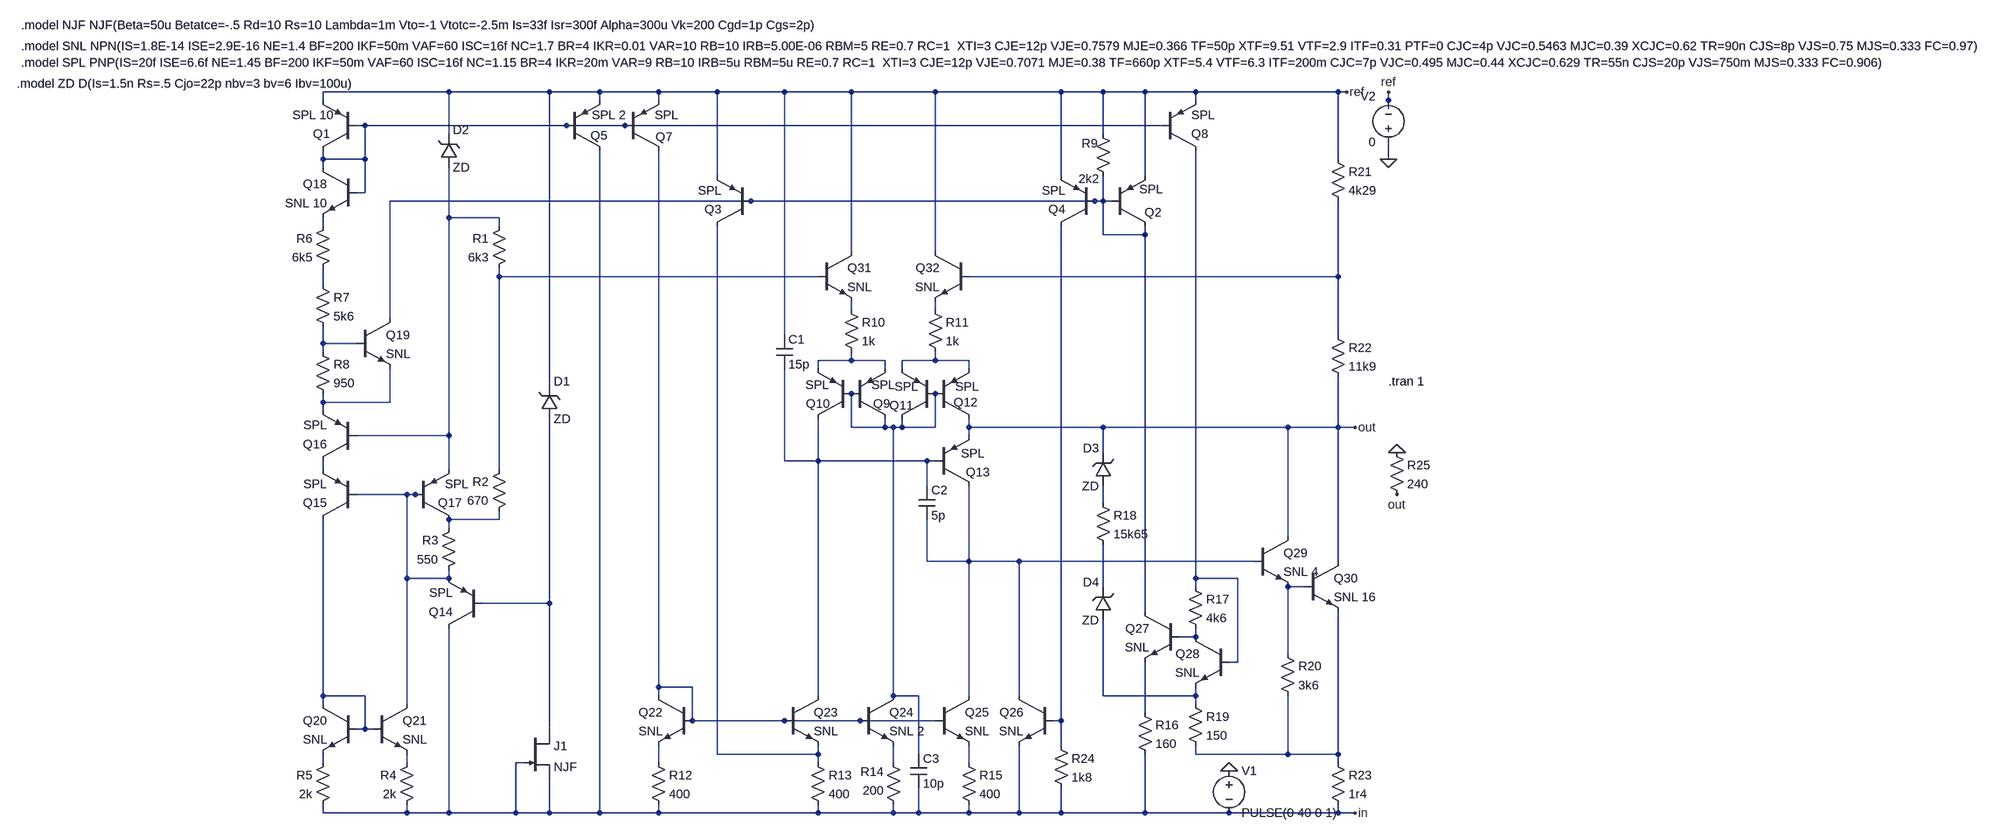
[diagram p0: schematic 79L24_test.asc]
79L24_test.asc, the LTspice schematic file:
Version 4
SHEET 1 5476 776
WIRE 2096 -736 1856 -736
WIRE 2288 -736 2096 -736
WIRE 2384 -736 2288 -736
WIRE 2496 -736 2384 -736
WIRE 2608 -736 2496 -736
WIRE 2736 -736 2608 -736
WIRE 2864 -736 2736 -736
WIRE 3024 -736 2864 -736
WIRE 3264 -736 3024 -736
WIRE 3344 -736 3264 -736
WIRE 3424 -736 3344 -736
WIRE 3520 -736 3424 -736
WIRE 3792 -736 3520 -736
WIRE 3808 -736 3792 -736
WIRE 1856 -720 1856 -736
WIRE 2384 -720 2384 -736
WIRE 2496 -720 2496 -736
WIRE 3520 -720 3520 -736
WIRE 3888 -720 3888 -736
WIRE 3888 -704 3888 -720
WIRE 1936 -672 1920 -672
WIRE 2320 -672 1936 -672
WIRE 2432 -672 2320 -672
WIRE 3456 -672 2432 -672
WIRE 2096 -656 2096 -736
WIRE 3344 -656 3344 -736
WIRE 1856 -608 1856 -624
WIRE 1936 -608 1936 -672
WIRE 1936 -608 1856 -608
WIRE 3792 -608 3792 -736
WIRE 3888 -608 3888 -640
WIRE 1856 -592 1856 -608
WIRE 2608 -576 2608 -736
WIRE 3264 -576 3264 -736
WIRE 3424 -576 3424 -736
WIRE 1936 -544 1936 -608
WIRE 1936 -544 1920 -544
WIRE 2672 -528 1984 -528
WIRE 3328 -528 2672 -528
WIRE 3344 -528 3344 -576
WIRE 3344 -528 3328 -528
WIRE 3360 -528 3344 -528
WIRE 2096 -496 2096 -592
WIRE 2192 -496 2096 -496
WIRE 1856 -480 1856 -496
WIRE 2192 -480 2192 -496
WIRE 3344 -464 3344 -528
WIRE 3424 -464 3424 -480
WIRE 3424 -464 3344 -464
WIRE 2864 -432 2864 -736
WIRE 3024 -432 3024 -736
WIRE 2192 -384 2192 -400
WIRE 2800 -384 2192 -384
WIRE 3792 -384 3792 -528
WIRE 3792 -384 3088 -384
WIRE 1856 -368 1856 -400
WIRE 2864 -320 2864 -336
WIRE 3024 -320 3024 -336
WIRE 1984 -304 1984 -528
WIRE 2736 -272 2736 -736
WIRE 3792 -272 3792 -384
WIRE 1856 -256 1856 -288
WIRE 1920 -256 1856 -256
WIRE 1856 -240 1856 -256
WIRE 2864 -224 2864 -240
WIRE 2864 -224 2800 -224
WIRE 2928 -224 2864 -224
WIRE 3024 -224 3024 -240
WIRE 3024 -224 2960 -224
WIRE 3088 -224 3024 -224
WIRE 2800 -208 2800 -224
WIRE 2928 -208 2928 -224
WIRE 2960 -208 2960 -224
WIRE 3088 -208 3088 -224
WIRE 2288 -176 2288 -736
WIRE 1856 -144 1856 -160
WIRE 1984 -144 1984 -208
WIRE 1984 -144 1856 -144
WIRE 1856 -128 1856 -144
WIRE 2864 -96 2864 -160
WIRE 2928 -96 2928 -112
WIRE 2928 -96 2864 -96
WIRE 2944 -96 2928 -96
WIRE 2960 -96 2960 -112
WIRE 2960 -96 2944 -96
WIRE 3024 -96 3024 -160
WIRE 3024 -96 2960 -96
WIRE 3088 -96 3088 -112
WIRE 3344 -96 3088 -96
WIRE 3696 -96 3344 -96
WIRE 3792 -96 3792 -192
WIRE 3792 -96 3696 -96
WIRE 3824 -96 3792 -96
WIRE 2096 -80 2096 -496
WIRE 2096 -80 1920 -80
WIRE 3088 -80 3088 -96
WIRE 3344 -48 3344 -96
WIRE 2736 -32 2736 -208
WIRE 2800 -32 2800 -112
WIRE 2800 -32 2736 -32
WIRE 3008 -32 2800 -32
WIRE 3024 -32 3008 -32
WIRE 1856 -16 1856 -32
WIRE 2096 -16 2096 -80
WIRE 2192 -16 2192 -384
WIRE 3008 16 3008 -32
WIRE 2016 32 1920 32
WIRE 2032 32 2016 32
WIRE 2048 32 2032 32
WIRE 3344 48 3344 16
WIRE 2192 80 2192 64
WIRE 2192 80 2096 80
WIRE 2096 96 2096 80
WIRE 3696 112 3696 -96
WIRE 3008 160 3008 80
WIRE 3088 160 3088 16
WIRE 3088 160 3008 160
WIRE 3184 160 3088 160
WIRE 3632 160 3184 160
WIRE 3792 160 3792 -96
WIRE 2016 192 2016 32
WIRE 2096 192 2096 176
WIRE 2096 192 2016 192
WIRE 3520 192 3520 -624
WIRE 3600 192 3520 192
WIRE 3344 208 3344 128
WIRE 3520 208 3520 192
WIRE 3728 208 3696 208
WIRE 2288 240 2288 -112
WIRE 2288 240 2160 240
WIRE 3424 256 3424 -464
WIRE 3520 304 3520 288
WIRE 3520 304 3488 304
WIRE 3696 336 3696 208
WIRE 3600 352 3600 192
WIRE 3600 352 3584 352
WIRE 2496 400 2496 -624
WIRE 2560 400 2496 400
WIRE 1856 416 1856 80
WIRE 1936 416 1856 416
WIRE 2496 416 2496 400
WIRE 2800 416 2800 -32
WIRE 2944 416 2944 -96
WIRE 2992 416 2944 416
WIRE 3088 416 3088 160
WIRE 3184 416 3184 160
WIRE 3344 416 3344 272
WIRE 3520 416 3520 400
WIRE 3520 416 3344 416
WIRE 1856 432 1856 416
WIRE 2016 432 2016 192
WIRE 3520 432 3520 416
WIRE 3424 448 3424 352
WIRE 2560 464 2560 400
WIRE 2736 464 2560 464
WIRE 2880 464 2736 464
WIRE 3024 464 2880 464
WIRE 3264 464 3264 -480
WIRE 3264 464 3248 464
WIRE 1936 480 1936 416
WIRE 1936 480 1920 480
WIRE 1952 480 1936 480
WIRE 2288 480 2288 240
WIRE 3264 512 3264 464
WIRE 2608 528 2608 -480
WIRE 2800 528 2800 512
WIRE 2800 528 2608 528
WIRE 2992 528 2992 416
WIRE 3520 528 3520 512
WIRE 3696 528 3696 416
WIRE 3696 528 3520 528
WIRE 3792 528 3792 256
WIRE 3792 528 3696 528
WIRE 1856 544 1856 528
WIRE 2016 544 2016 528
WIRE 2240 544 2224 544
WIRE 2496 544 2496 512
WIRE 2800 544 2800 528
WIRE 2944 544 2944 512
WIRE 3088 544 3088 512
WIRE 3792 544 3792 528
WIRE 1856 640 1856 624
WIRE 2016 640 2016 624
WIRE 2016 640 1856 640
WIRE 2096 640 2096 288
WIRE 2096 640 2016 640
WIRE 2224 640 2224 544
WIRE 2224 640 2096 640
WIRE 2288 640 2288 576
WIRE 2288 640 2224 640
WIRE 2384 640 2384 -624
WIRE 2384 640 2288 640
WIRE 2496 640 2496 624
WIRE 2496 640 2384 640
WIRE 2800 640 2800 624
WIRE 2800 640 2496 640
WIRE 2944 640 2944 624
WIRE 2944 640 2800 640
WIRE 2992 640 2992 592
WIRE 2992 640 2944 640
WIRE 3088 640 3088 624
WIRE 3088 640 2992 640
WIRE 3184 640 3184 512
WIRE 3184 640 3088 640
WIRE 3264 640 3264 592
WIRE 3264 640 3184 640
WIRE 3424 640 3424 528
WIRE 3424 640 3264 640
WIRE 3584 640 3424 640
WIRE 3792 640 3792 624
WIRE 3792 640 3584 640
WIRE 3824 640 3792 640
FLAG 3824 640 in
FLAG 3824 -96 out
FLAG 3584 560 0
FLAG 3904 -48 0
FLAG 3904 32 out
FLAG 3888 -608 0
FLAG 3808 -736 ref
FLAG 3888 -736 ref
SYMBOL res 2208 -496 M0
SYMATTR InstName R1
SYMATTR Value 6k3
SYMBOL res 2208 -32 M0
SYMATTR InstName R2
SYMATTR Value 670
SYMBOL res 2112 80 M0
SYMATTR InstName R3
SYMATTR Value 550
SYMBOL res 2032 528 M0
SYMATTR InstName R4
SYMATTR Value 2k
SYMBOL res 1872 528 M0
SYMATTR InstName R5
SYMATTR Value 2k
SYMBOL res 1872 -496 M0
SYMATTR InstName R6
SYMATTR Value 6k5
SYMBOL res 1840 -384 R0
SYMATTR InstName R7
SYMATTR Value 5k6
SYMBOL res 1840 -256 R0
SYMATTR InstName R8
SYMATTR Value 950
SYMBOL res 3328 -672 R0
WINDOW 0 -25 34 Left 0
WINDOW 3 -31 102 Left 0
SYMATTR InstName R9
SYMATTR Value 2k2
SYMBOL res 2848 -336 R0
SYMATTR InstName R10
SYMATTR Value 1k
SYMBOL res 3008 -336 R0
SYMATTR InstName R11
SYMATTR Value 1k
SYMBOL res 2480 528 R0
SYMATTR InstName R12
SYMATTR Value 400
SYMBOL res 2784 528 R0
SYMATTR InstName R13
SYMATTR Value 400
SYMBOL res 2928 528 R0
WINDOW 0 -47 33 Left 0
WINDOW 3 -43 69 Left 0
SYMATTR InstName R14
SYMATTR Value 200
SYMBOL res 3072 528 R0
SYMATTR InstName R15
SYMATTR Value 400
SYMBOL res 3408 432 R0
SYMATTR InstName R16
SYMATTR Value 160
SYMBOL res 3504 192 R0
SYMATTR InstName R17
SYMATTR Value 4k6
SYMBOL res 3328 32 R0
SYMATTR InstName R18
SYMATTR Value 15k65
SYMBOL res 3504 416 R0
SYMATTR InstName R19
SYMATTR Value 150
SYMBOL res 3680 320 R0
SYMATTR InstName R20
SYMATTR Value 3k6
SYMBOL res 3776 -624 R0
SYMATTR InstName R21
SYMATTR Value 4k29
SYMBOL res 3776 -288 R0
SYMATTR InstName R22
SYMATTR Value 11k9
SYMBOL res 3776 528 R0
SYMATTR InstName R23
SYMATTR Value 1r4
SYMBOL res 3248 496 R0
SYMATTR InstName R24
SYMATTR Value 1k8
SYMBOL cap 2720 -272 R0
SYMATTR InstName C1
SYMATTR Value 15p
SYMBOL cap 2992 16 R0
SYMATTR InstName C2
SYMATTR Value 5p
SYMBOL cap 2976 528 R0
SYMATTR InstName C3
SYMATTR Value 10p
SYMBOL zener 2272 -112 M180
WINDOW 0 24 72 Left 0
WINDOW 3 24 0 Left 0
SYMATTR InstName D1
SYMATTR Value ZD
SYMBOL zener 2080 -592 M180
WINDOW 0 24 72 Left 0
WINDOW 3 24 0 Left 0
SYMATTR InstName D2
SYMATTR Value ZD
SYMBOL zener 3360 16 R180
WINDOW 0 24 72 Left 0
WINDOW 3 24 0 Left 0
SYMATTR InstName D3
SYMATTR Value ZD
SYMBOL zener 3360 272 R180
WINDOW 0 24 72 Left 0
WINDOW 3 24 0 Left 0
SYMATTR InstName D4
SYMATTR Value ZD
SYMBOL pnp 1920 -624 R180
WINDOW 0 51 32 Left 0
WINDOW 3 43 68 Left 0
SYMATTR InstName Q1
SYMATTR Value SPL 10
SYMBOL pnp 3360 -480 M180
WINDOW 0 63 26 Left 0
WINDOW 3 53 70 Left 0
SYMATTR InstName Q2
SYMATTR Value SPL
SYMBOL pnp 2672 -480 R180
SYMATTR InstName Q3
SYMATTR Value SPL
SYMBOL pnp 3328 -480 R180
SYMATTR InstName Q4
SYMATTR Value SPL
SYMBOL pnp 2320 -624 M180
WINDOW 0 46 29 Left 0
WINDOW 3 49 68 Left 0
SYMATTR InstName Q5
SYMATTR Value SPL 2
SYMBOL pnp 2432 -624 M180
WINDOW 0 58 26 Left 0
WINDOW 3 57 68 Left 0
SYMATTR InstName Q7
SYMATTR Value SPL
SYMBOL pnp 3456 -624 M180
SYMATTR InstName Q8
SYMATTR Value SPL
SYMBOL pnp 2864 -112 M180
WINDOW 0 41 29 Left 0
WINDOW 3 38 65 Left 0
SYMATTR InstName Q9
SYMATTR Value SPL
SYMBOL pnp 2864 -112 R180
WINDOW 0 41 29 Left 0
WINDOW 3 43 65 Left 0
SYMATTR InstName Q10
SYMATTR Value SPL
SYMBOL pnp 3024 -112 R180
WINDOW 0 42 26 Left 0
WINDOW 3 33 62 Left 0
SYMATTR InstName Q11
SYMATTR Value SPL
SYMBOL pnp 3024 -112 M180
WINDOW 0 35 32 Left 0
WINDOW 3 38 62 Left 0
SYMATTR InstName Q12
SYMATTR Value SPL
SYMBOL pnp 3024 16 M180
WINDOW 0 58 26 Left 0
WINDOW 3 49 62 Left 0
SYMATTR InstName Q13
SYMATTR Value SPL
SYMBOL pnp 2160 288 R180
SYMATTR InstName Q14
SYMATTR Value SPL
SYMBOL pnp 1920 80 R180
SYMATTR InstName Q15
SYMATTR Value SPL
SYMBOL pnp 1920 -32 R180
SYMATTR InstName Q16
SYMATTR Value SPL
SYMBOL pnp 2032 80 M180
WINDOW 0 43 32 Left 0
WINDOW 3 57 68 Left 0
SYMATTR InstName Q17
SYMATTR Value SPL
SYMBOL npn 1920 -592 M0
SYMATTR InstName Q18
SYMATTR Value SNL 10
SYMBOL npn 1920 -304 R0
SYMATTR InstName Q19
SYMATTR Value SNL
SYMBOL npn 1920 432 M0
SYMATTR InstName Q20
SYMATTR Value SNL
SYMBOL npn 1952 432 R0
SYMATTR InstName Q21
SYMATTR Value SNL
SYMBOL npn 2560 416 M0
SYMATTR InstName Q22
SYMATTR Value SNL
SYMBOL npn 2736 416 R0
SYMATTR InstName Q23
SYMATTR Value SNL
SYMBOL npn 2880 416 R0
SYMATTR InstName Q24
SYMATTR Value SNL 2
SYMBOL npn 3024 416 R0
SYMATTR InstName Q25
SYMATTR Value SNL
SYMBOL npn 3248 416 M0
SYMATTR InstName Q26
SYMATTR Value SNL
SYMBOL npn 3488 256 M0
SYMATTR InstName Q27
SYMATTR Value SNL
SYMBOL npn 3584 304 M0
SYMATTR InstName Q28
SYMATTR Value SNL
SYMBOL npn 3632 112 R0
SYMATTR InstName Q29
SYMATTR Value SNL 4
SYMBOL npn 3728 160 R0
SYMATTR InstName Q30
SYMATTR Value SNL 16
SYMBOL npn 2800 -432 R0
SYMATTR InstName Q31
SYMATTR Value SNL
SYMBOL npn 3088 -432 M0
SYMATTR InstName Q32
SYMATTR Value SNL
SYMBOL njf 2240 480 R0
SYMATTR InstName J1
SYMBOL voltage 3584 544 R0
WINDOW 123 0 0 Left 0
WINDOW 39 0 0 Left 0
SYMATTR InstName V1
SYMATTR Value PULSE(0 40 0 1)
SYMBOL res 3888 -64 R0
SYMATTR InstName R25
SYMATTR Value 240
SYMBOL voltage 3888 -624 R180
WINDOW 0 24 104 Left 0
WINDOW 3 24 16 Left 0
WINDOW 123 0 0 Left 0
WINDOW 39 0 0 Left 0
SYMATTR InstName V2
SYMATTR Value 0
TEXT 3888 -184 Left 0 !.tran 1
TEXT 1272 -752 Left 0 !.model ZD D(Is=1.5n Rs=.5 Cjo=22p nbv=3 bv=6 Ibv=100u)
TEXT 1280 -824 Left 0 !.model SNL NPN(IS=1.8E-14 ISE=2.9E-16 NE=1.4 BF=200 IKF=50m VAF=60 ISC=16f NC=1.7 BR=4 IKR=0.01 VAR=10 RB=10 IRB=5.00E-06 RBM=5 RE=0.7 RC=1  XTI=3 CJE=12p VJE=0.7579 MJE=0.366 TF=50p XTF=9.51 VTF=2.9 ITF=0.31 PTF=0 CJC=4p VJC=0.5463 MJC=0.39 XCJC=0.62 TR=90n CJS=8p VJS=0.75 MJS=0.333 FC=0.97)
TEXT 1280 -792 Left 0 !.model SPL PNP(IS=20f ISE=6.6f NE=1.45 BF=200 IKF=50m VAF=60 ISC=16f NC=1.15 BR=4 IKR=20m VAR=9 RB=10 IRB=5u RBM=5u RE=0.7 RC=1  XTI=3 CJE=12p VJE=0.7071 MJE=0.38 TF=660p XTF=5.4 VTF=6.3 ITF=200m CJC=7p VJC=0.495 MJC=0.44 XCJC=0.629 TR=55n CJS=20p VJS=750m MJS=0.333 FC=0.906)
TEXT 1280 -864 Left 0 !.model NJF NJF(Beta=50u Betatce=-.5 Rd=10 Rs=10 Lambda=1m Vto=-1 Vtotc=-2.5m Is=33f Isr=300f Alpha=300u Vk=200 Cgd=1p Cgs=2p)

The netlist it stands for:
* 79L24_test.asc
R1 N003 N005 6k3
R2 N005 N019 670
R3 N019 N017 550
R4 N034 in 2k
R5 N033 in 2k
R6 N004 N007 6k5
R7 N007 N010 5k6
R8 N010 N013 950
R9 ref N002 2k2
R10 N008 N011 1k
R11 N009 N012 1k
R12 N035 in 400
R13 N031 in 400
R14 N036 in 200
R15 N037 in 400
R16 N029 in 160
R17 N021 N025 4k6
R18 N018 N022 15k65
R19 N028 N032 150
R20 N023 N032 3k6
R21 ref N006 4k29
R22 N006 out 11k9
R23 N032 in 1r4
R24 N030 in 1k8
C1 ref N015 15p
C2 N015 N020 5p
C3 N014 in 10p
D1 N024 ref ZD
D2 N003 ref ZD
D3 N018 out ZD
D4 N028 N022 ZD
Q1 N001 N001 ref 0 SPL 10
Q2 N002 N002 ref 0 SPL
Q3 N031 N002 ref 0 SPL
Q4 N030 N002 ref 0 SPL
Q5 in N001 ref 0 SPL 2
Q7 N026 N001 ref 0 SPL
Q8 N021 N001 ref 0 SPL
Q9 N014 N014 N011 0 SPL
Q10 N015 N014 N011 0 SPL
Q11 N014 N014 N012 0 SPL
Q12 out N014 N012 0 SPL
Q13 N020 N015 out 0 SPL
Q14 in N024 N017 0 SPL
Q15 N027 N017 N016 0 SPL
Q16 N016 N003 N013 0 SPL
Q17 N019 N017 N003 0 SPL
Q18 N001 N001 N004 0 SNL 10
Q19 N002 N010 N013 0 SNL
Q20 N027 N027 N033 0 SNL
Q21 N017 N027 N034 0 SNL
Q22 N026 N026 N035 0 SNL
Q23 N015 N026 N031 0 SNL
Q24 N014 N026 N036 0 SNL 2
Q25 N020 N026 N037 0 SNL
Q26 N020 N030 in 0 SNL
Q27 N002 N025 N029 0 SNL
Q28 N025 N021 N028 0 SNL
Q29 out N020 N023 0 SNL 4
Q30 out N023 N032 0 SNL 16
Q31 ref N005 N008 0 SNL
Q32 ref N006 N009 0 SNL
J1 N024 in in NJF
V1 0 in PULSE(0 40 0 1)
R25 0 out 240
V2 0 ref 0
.model D D
.lib standard.dio
.model NPN NPN
.model PNP PNP
.lib standard.bjt
.model NJF NJF
.model PJF PJF
.lib standard.jft
.tran 1
.model ZD D(Is=1.5n Rs=.5 Cjo=22p nbv=3 bv=6 Ibv=100u)
.model SNL NPN(IS=1.8E-14 ISE=2.9E-16 NE=1.4 BF=200 IKF=50m VAF=60 ISC=16f NC=1.7 BR=4 IKR=0.01 VAR=10 RB=10 IRB=5.00E-06 RBM=5 RE=0.7 RC=1  XTI=3 CJE=12p VJE=0.7579 MJE=0.366 TF=50p XTF=9.51 VTF=2.9 ITF=0.31 PTF=0 CJC=4p VJC=0.5463 MJC=0.39 XCJC=0.62 TR=90n CJS=8p VJS=0.75 MJS=0.333 FC=0.97)
.model SPL PNP(IS=20f ISE=6.6f NE=1.45 BF=200 IKF=50m VAF=60 ISC=16f NC=1.15 BR=4 IKR=20m VAR=9 RB=10 IRB=5u RBM=5u RE=0.7 RC=1  XTI=3 CJE=12p VJE=0.7071 MJE=0.38 TF=660p XTF=5.4 VTF=6.3 ITF=200m CJC=7p VJC=0.495 MJC=0.44 XCJC=0.629 TR=55n CJS=20p VJS=750m MJS=0.333 FC=0.906)
.model NJF NJF(Beta=50u Betatce=-.5 Rd=10 Rs=10 Lambda=1m Vto=-1 Vtotc=-2.5m Is=33f Isr=300f Alpha=300u Vk=200 Cgd=1p Cgs=2p)
.backanno
.end